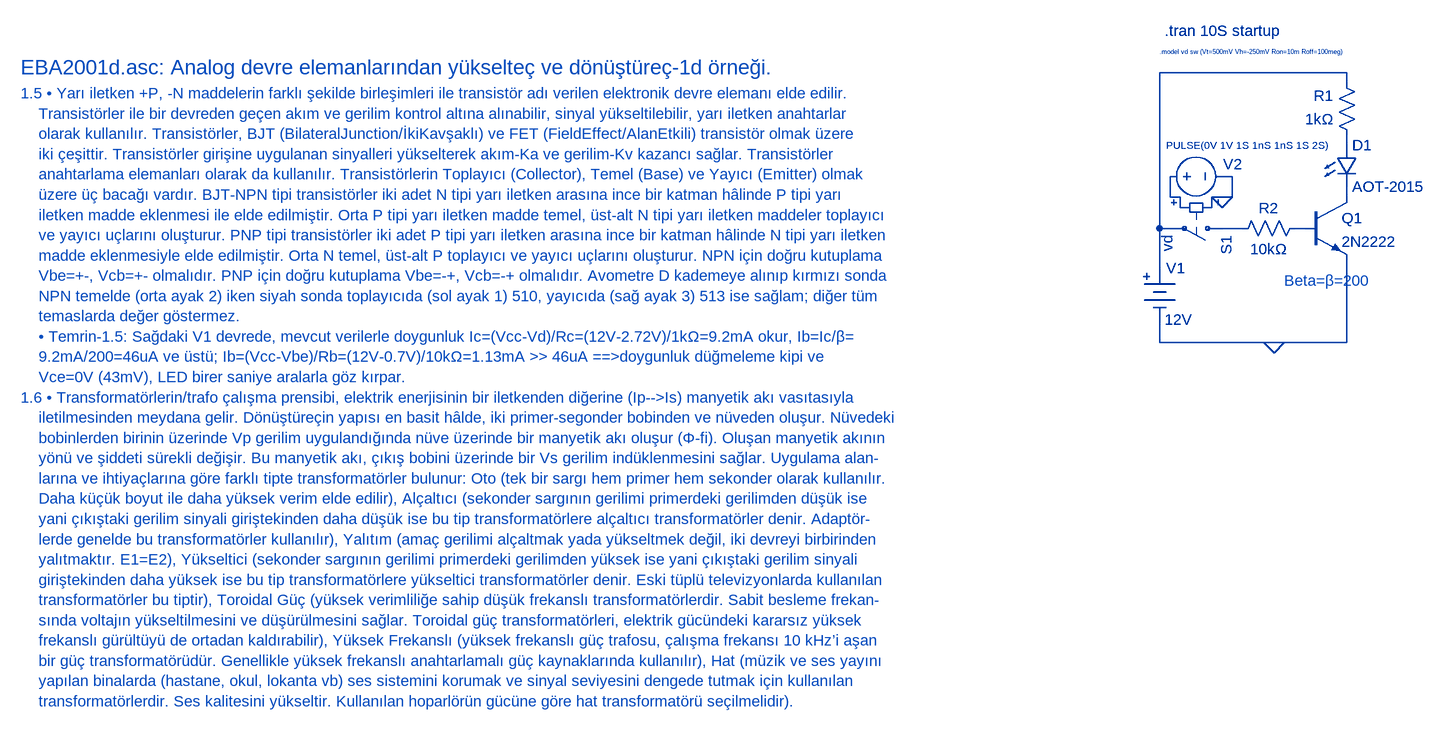
[diagram p0: schematic EBA2001d.asc]
EBA2001d.asc, the LTspice schematic file:
Version 4
SHEET 1 7064 4332
WIRE 1808 64 1520 64
WIRE 1808 80 1808 64
WIRE 1808 176 1808 160
WIRE 1632 224 1616 224
WIRE 1536 256 1536 224
WIRE 1552 256 1536 256
WIRE 1616 256 1600 256
WIRE 1632 256 1632 224
WIRE 1632 256 1616 256
WIRE 1808 256 1808 240
WIRE 1520 304 1520 64
WIRE 1536 304 1520 304
WIRE 1648 304 1616 304
WIRE 1744 304 1728 304
WIRE 1520 368 1520 304
WIRE 1520 480 1520 448
WIRE 1696 480 1520 480
WIRE 1808 480 1808 352
WIRE 1808 480 1696 480
FLAG 1696 480 0
FLAG 1616 256 0
SYMBOL Misc\\battery 1520 352 R0
WINDOW 0 10 13 Left 2
WINDOW 3 8 92 Left 2
SYMATTR InstName V1
SYMATTR Value 12V
SYMBOL res 1824 176 R180
WINDOW 0 36 76 Left 2
WINDOW 3 36 40 Left 2
SYMATTR InstName R1
SYMATTR Value 1kΩ
SYMBOL LED 1792 176 R0
SYMATTR InstName D1
SYMATTR Value AOT-2015
SYMATTR Description Diode
SYMATTR Type diode
SYMBOL npn 1744 256 R0
SYMATTR InstName Q1
SYMATTR Value 2N2222
SYMBOL res 1632 320 R270
WINDOW 0 32 56 VTop 2
WINDOW 3 0 56 VBottom 2
SYMATTR InstName R2
SYMATTR Value 10kΩ
SYMBOL sw 1632 304 R90
WINDOW 0 11 9 Left 2
WINDOW 3 10 100 Left 2
SYMATTR InstName S1
SYMATTR Value vd
SYMBOL voltage 1520 224 R270
WINDOW 0 19 98 VRight 2
WINDOW 3 48 10 VRight 1
WINDOW 123 0 0 Left 0
WINDOW 39 0 0 Left 0
SYMATTR InstName V2
SYMATTR Value PULSE(0V 1V 1S 1nS 1nS 1S 2S)
TEXT -232 56 Left 3 ;EBA2001d.asc: Analog devre elemanlarından yükselteç ve dönüştüreç-1d örneği.
TEXT -232 96 Left 2 ;1.5 • Yarı iletken +P, -N maddelerin farklı şekilde birleşimleri ile transistör adı verilen elektronik devre elemanı elde edilir. \n    Transistörler ile bir devreden geçen akım ve gerilim kontrol altına alınabilir, sinyal yükseltilebilir, yarı iletken anahtarlar \n    olarak kullanılır. Transistörler, BJT (BilateralJunction/İkiKavşaklı) ve FET (FieldEffect/AlanEtkili) transistör olmak üzere \n    iki çeşittir. Transistörler girişine uygulanan sinyalleri yükselterek akım-Ka ve gerilim-Kv kazancı sağlar. Transistörler \n    anahtarlama elemanları olarak da kullanılır. Transistörlerin Toplayıcı (Collector), Temel (Base) ve Yayıcı (Emitter) olmak \n    üzere üç bacağı vardır. BJT-NPN tipi transistörler iki adet N tipi yarı iletken arasına ince bir katman hâlinde P tipi yarı \n    iletken madde eklenmesi ile elde edilmiştir. Orta P tipi yarı iletken madde temel, üst-alt N tipi yarı iletken maddeler toplayıcı\n    ve yayıcı uçlarını oluşturur. PNP tipi transistörler iki adet P tipi yarı iletken arasına ince bir katman hâlinde N tipi yarı iletken\n    madde eklenmesiyle elde edilmiştir. Orta N temel, üst-alt P toplayıcı ve yayıcı uçlarını oluşturur. NPN için doğru kutuplama\n    Vbe=+-, Vcb=+- olmalıdır. PNP için doğru kutuplama Vbe=-+, Vcb=-+ olmalıdır. Avometre D kademeye alınıp kırmızı sonda\n    NPN temelde (orta ayak 2) iken siyah sonda toplayıcıda (sol ayak 1) 510, yayıcıda (sağ ayak 3) 513 ise sağlam; diğer tüm \n    temaslarda değer göstermez.\n    • Temrin-1.5: Sağdaki V1 devrede, mevcut verilerle doygunluk Ic=(Vcc-Vd)/Rc=(12V-2.72V)/1kΩ=9.2mA okur, Ib=Ic/β=\n    9.2mA/200=46uA ve üstü; Ib=(Vcc-Vbe)/Rb=(12V-0.7V)/10kΩ=1.13mA >> 46uA ==>doygunluk düğmeleme kipi ve \n    Vce=0V (43mV), LED birer saniye aralarla göz kırpar.\n1.6 • Transformatörlerin/trafo çalışma prensibi, elektrik enerjisinin bir iletkenden diğerine (Ip-->Is) manyetik akı vasıtasıyla \n    iletilmesinden meydana gelir. Dönüştüreçin yapısı en basit hâlde, iki primer-segonder bobinden ve nüveden oluşur. Nüvedeki \n    bobinlerden birinin üzerinde Vp gerilim uygulandığında nüve üzerinde bir manyetik akı oluşur (Φ-fi). Oluşan manyetik akının\n    yönü ve şiddeti sürekli değişir. Bu manyetik akı, çıkış bobini üzerinde bir Vs gerilim indüklenmesini sağlar. Uygulama alan-\n    larına ve ihtiyaçlarına göre farklı tipte transformatörler bulunur: Oto (tek bir sargı hem primer hem sekonder olarak kullanılır. \n    Daha küçük boyut ile daha yüksek verim elde edilir), Alçaltıcı (sekonder sargının gerilimi primerdeki gerilimden düşük ise \n    yani çıkıştaki gerilim sinyali giriştekinden daha düşük ise bu tip transformatörlere alçaltıcı transformatörler denir. Adaptör-\n    lerde genelde bu transformatörler kullanılır), Yalıtım (amaç gerilimi alçaltmak yada yükseltmek değil, iki devreyi birbirinden \n    yalıtmaktır. E1=E2), Yükseltici (sekonder sargının gerilimi primerdeki gerilimden yüksek ise yani çıkıştaki gerilim sinyali \n    giriştekinden daha yüksek ise bu tip transformatörlere yükseltici transformatörler denir. Eski tüplü televizyonlarda kullanılan\n    transformatörler bu tiptir), Toroidal Güç (yüksek verimliliğe sahip düşük frekanslı transformatörlerdir. Sabit besleme frekan-\n    sında voltajın yükseltilmesini ve düşürülmesini sağlar. Toroidal güç transformatörleri, elektrik gücündeki kararsız yüksek \n    frekanslı gürültüyü de ortadan kaldırabilir), Yüksek Frekanslı (yüksek frekanslı güç trafosu, çalışma frekansı 10 kHz’i aşan \n    bir güç transformatörüdür. Genellikle yüksek frekanslı anahtarlamalı güç kaynaklarında kullanılır), Hat (müzik ve ses yayını\n    yapılan binalarda (hastane, okul, lokanta vb) ses sistemini korumak ve sinyal seviyesini dengede tutmak için kullanılan\n    transformatörlerdir. Ses kalitesini yükseltir. Kullanılan hoparlörün gücüne göre hat transformatörü seçilmelidir).
TEXT 1528 0 Left 2 !.tran 10S startup
TEXT 1712 384 Left 2 ;Beta=β=200
TEXT 1520 32 Left 0 !.model vd sw (Vt=500mV Vh=-250mV Ron=10m Roff=100meg)

The netlist it stands for:
* EBA2001d.asc
V1 N001 0 12V
R1 N002 N001 1kΩ
D1 N002 N004 AOT-2015
Q1 N004 N006 0 0 2N2222
R2 N005 N006 10kΩ
S1 N005 N001 N003 0 vd
V2 N003 0 PULSE(0V 1V 1S 1nS 1nS 1S 2S)
.model D D
.lib standard.dio
.model NPN NPN
.model PNP PNP
.lib standard.bjt
* EBA2001d.asc: Analog devre elemanlarından yükselteç ve dönüştüreç-1d örneği.
* 1.5 • Yarı iletken +P, -N maddelerin farklı şekilde birleşimleri ile transistör adı verilen elektronik devre elemanı elde edilir.
*     Transistörler ile bir devreden geçen akım ve gerilim kontrol altına alınabilir, sinyal yükseltilebilir, yarı iletken anahtarlar
*     olarak kullanılır. Transistörler, BJT (BilateralJunction/İkiKavşaklı) ve FET (FieldEffect/AlanEtkili) transistör olmak üzere
*     iki çeşittir. Transistörler girişine uygulanan sinyalleri yükselterek akım-Ka ve gerilim-Kv kazancı sağlar. Transistörler
*     anahtarlama elemanları olarak da kullanılır. Transistörlerin Toplayıcı (Collector), Temel (Base) ve Yayıcı (Emitter) olmak
*     üzere üç bacağı vardır. BJT-NPN tipi transistörler iki adet N tipi yarı iletken arasına ince bir katman hâlinde P tipi yarı
*     iletken madde eklenmesi ile elde edilmiştir. Orta P tipi yarı iletken madde temel, üst-alt N tipi yarı iletken maddeler toplayıcı
*     ve yayıcı uçlarını oluşturur. PNP tipi transistörler iki adet P tipi yarı iletken arasına ince bir katman hâlinde N tipi yarı iletken
*     madde eklenmesiyle elde edilmiştir. Orta N temel, üst-alt P toplayıcı ve yayıcı uçlarını oluşturur. NPN için doğru kutuplama
*     Vbe=+-, Vcb=+- olmalıdır. PNP için doğru kutuplama Vbe=-+, Vcb=-+ olmalıdır. Avometre D kademeye alınıp kırmızı sonda
*     NPN temelde (orta ayak 2) iken siyah sonda toplayıcıda (sol ayak 1) 510, yayıcıda (sağ ayak 3) 513 ise sağlam; diğer tüm
*     temaslarda değer göstermez.
*     • Temrin-1.5: Sağdaki V1 devrede, mevcut verilerle doygunluk Ic=(Vcc-Vd)/Rc=(12V-2.72V)/1kΩ=9.2mA okur, Ib=Ic/β=
*     9.2mA/200=46uA ve üstü; Ib=(Vcc-Vbe)/Rb=(12V-0.7V)/10kΩ=1.13mA >> 46uA ==>doygunluk düğmeleme kipi ve
*     Vce=0V (43mV), LED birer saniye aralarla göz kırpar.
* 1.6 • Transformatörlerin/trafo çalışma prensibi, elektrik enerjisinin bir iletkenden diğerine (Ip-->Is) manyetik akı vasıtasıyla
*     iletilmesinden meydana gelir. Dönüştüreçin yapısı en basit hâlde, iki primer-segonder bobinden ve nüveden oluşur. Nüvedeki
*     bobinlerden birinin üzerinde Vp gerilim uygulandığında nüve üzerinde bir manyetik akı oluşur (Φ-fi). Oluşan manyetik akının
*     yönü ve şiddeti sürekli değişir. Bu manyetik akı, çıkış bobini üzerinde bir Vs gerilim indüklenmesini sağlar. Uygulama alan-
*     larına ve ihtiyaçlarına göre farklı tipte transformatörler bulunur: Oto (tek bir sargı hem primer hem sekonder olarak kullanılır.
*     Daha küçük boyut ile daha yüksek verim elde edilir), Alçaltıcı (sekonder sargının gerilimi primerdeki gerilimden düşük ise
*     yani çıkıştaki gerilim sinyali giriştekinden daha düşük ise bu tip transformatörlere alçaltıcı transformatörler denir. Adaptör-
*     lerde genelde bu transformatörler kullanılır), Yalıtım (amaç gerilimi alçaltmak yada yükseltmek değil, iki devreyi birbirinden
*     yalıtmaktır. E1=E2), Yükseltici (sekonder sargının gerilimi primerdeki gerilimden yüksek ise yani çıkıştaki gerilim sinyali
*     giriştekinden daha yüksek ise bu tip transformatörlere yükseltici transformatörler denir. Eski tüplü televizyonlarda kullanılan
*     transformatörler bu tiptir), Toroidal Güç (yüksek verimliliğe sahip düşük frekanslı transformatörlerdir. Sabit besleme frekan-
*     sında voltajın yükseltilmesini ve düşürülmesini sağlar. Toroidal güç transformatörleri, elektrik gücündeki kararsız yüksek
*     frekanslı gürültüyü de ortadan kaldırabilir), Yüksek Frekanslı (yüksek frekanslı güç trafosu, çalışma frekansı 10 kHz’i aşan
*     bir güç transformatörüdür. Genellikle yüksek frekanslı anahtarlamalı güç kaynaklarında kullanılır), Hat (müzik ve ses yayını
*     yapılan binalarda (hastane, okul, lokanta vb) ses sistemini korumak ve sinyal seviyesini dengede tutmak için kullanılan
*     transformatörlerdir. Ses kalitesini yükseltir. Kullanılan hoparlörün gücüne göre hat transformatörü seçilmelidir).
.tran 10S startup
* Beta=β=200
.model vd sw (Vt=500mV Vh=-250mV Ron=10m Roff=100meg)
.backanno
.end